# Altium schematic sheet Audio_Input_Line_In.SchDoc: Audio In
size 279 x 215 mm; DrawnBy: Connor Dack; Engineer: Connor Dack; DocumentNumber: 9; Revision: 1.0; SheetNumber: 9; SheetTotal: 11
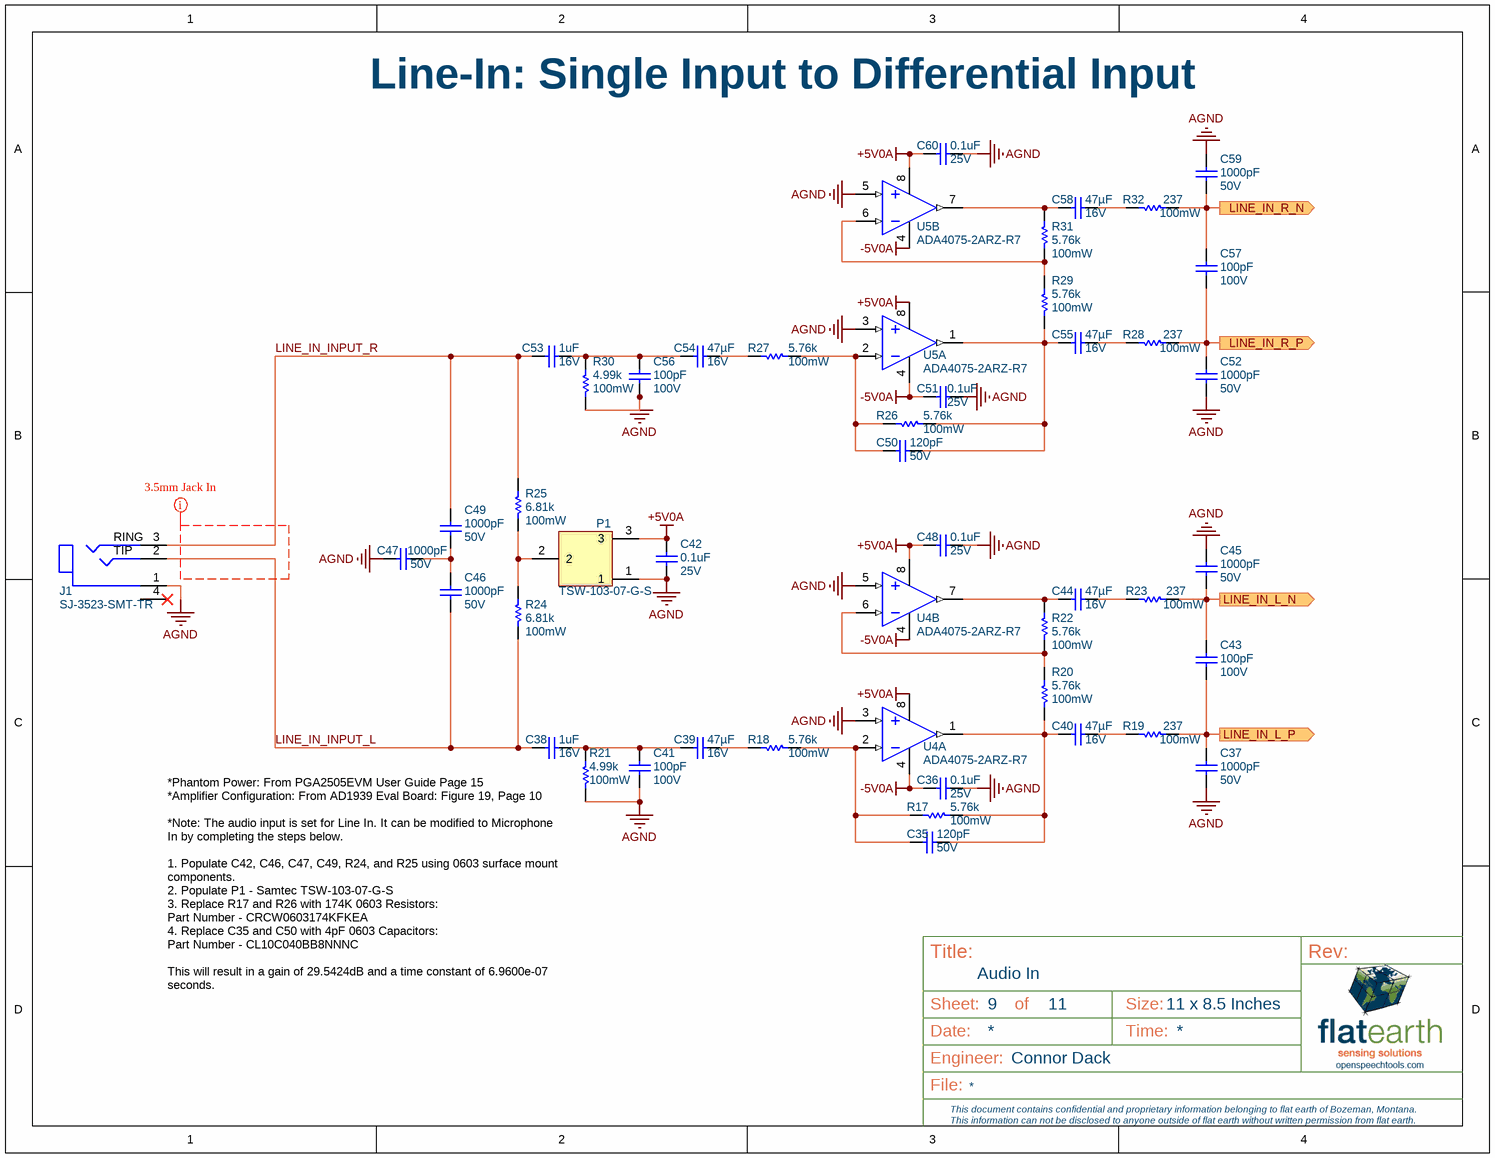
[diagram p0: Audio_Input_Line_In.SchDoc]

## Parts
C35  Voltage - Rated: 50V  Capacitance: 120pF  [3-0603_L]  (hidden comment: CL10C121JB8NCNC)
C36  Voltage Rating: 25V  Capacitance: 0.1uF  [3-0603_L]  (hidden comment: CGA3E2X7R1E104K080AA)
C37  Voltage - Rated: 50V  Capacitance: 1000pF  [3-0603_L]  (hidden comment: CL10B102KB8NNNC)
C38  Voltage Rating (DC): 16V  Capacitance: 1uF  [3-0603_L]  (hidden comment: CGA3E1X7R1C105M080AC)
C39  Voltage - Rated: 16V  Capacitance: 47µF  [C1210X25_L]  (hidden comment: GRM32EC81C476KE15L)
C40  Voltage - Rated: 16V  Capacitance: 47µF  [C1210X25_L]  (hidden comment: GRM32EC81C476KE15L)
C41  Voltage - Rated: 100V  Capacitance: 100pF  [3-0603_L]  (hidden comment: C1608C0G2A101J)
C42  Voltage Rating: 25V  Capacitance: 0.1uF  [3-0603_L]  (hidden comment: CGA3E2X7R1E104K080AA)
C43  Voltage - Rated: 100V  Capacitance: 100pF  [3-0603_L]  (hidden comment: C1608C0G2A101J)
C44  Voltage - Rated: 16V  Capacitance: 47µF  [C1210X25_L]  (hidden comment: GRM32EC81C476KE15L)
C45  Voltage - Rated: 50V  Capacitance: 1000pF  [3-0603_L]  (hidden comment: CL10B102KB8NNNC)
C46  Voltage - Rated: 50V  Capacitance: 1000pF  [3-0603_L_DNP]  (hidden comment: C1608C0G1H102J)
C47  Voltage - Rated: 50V  Capacitance: 1000pF  [3-0603_L_DNP]  (hidden comment: C1608C0G1H102J)
C48  Voltage Rating: 25V  Capacitance: 0.1uF  [3-0603_L]  (hidden comment: CGA3E2X7R1E104K080AA)
C49  Voltage - Rated: 50V  Capacitance: 1000pF  [3-0603_L_DNP]  (hidden comment: C1608C0G1H102J)
C50  Voltage - Rated: 50V  Capacitance: 120pF  [3-0603_L]  (hidden comment: CL10C121JB8NCNC)
C51  Voltage Rating: 25V  Capacitance: 0.1uF  [3-0603_L]  (hidden comment: CGA3E2X7R1E104K080AA)
C52  Voltage - Rated: 50V  Capacitance: 1000pF  [3-0603_L]  (hidden comment: CL10B102KB8NNNC)
C53  Voltage Rating: 16V  Capacitance: 1uF  [3-0603_L]  (hidden comment: CGA3E1X7R1C105M080AC)
C54  Voltage - Rated: 16V  Capacitance: 47µF  [C1210X25_L]  (hidden comment: GRM32EC81C476KE15L)
C55  Voltage - Rated: 16V  Capacitance: 47µF  [C1210X25_L]  (hidden comment: GRM32EC81C476KE15L)
C56  Voltage - Rated: 100V  Capacitance: 100pF  [3-0603_L]  (hidden comment: C1608C0G2A101J)
C57  Voltage - Rated: 100V  Capacitance: 100pF  [3-0603_L]  (hidden comment: C1608C0G2A101J)
C58  Voltage - Rated: 16V  Capacitance: 47µF  [C1210X25_L]  (hidden comment: GRM32EC81C476KE15L)
C59  Voltage - Rated: 50V  Capacitance: 1000pF  [3-0603_L]  (hidden comment: CL10B102KB8NNNC)
C60  Voltage Rating: 25V  Capacitance: 0.1uF  [3-0603_L]  (hidden comment: CGA3E2X7R1E104K080AA)
J1  SJ-3523-SMT-TR  [SJ-3523-SMT-TR]
P1  TSW-103-07-G-S  [3Pin_Header]
R17  Power (Watts): 100mW  Resistance (Ohms): 5.76k  [3-0603_R_L]  (hidden comment: ERJ-3EKF5761V)
R18  Power (Watts): 100mW  Resistance (Ohms): 5.76k  [3-0603_R_L]  (hidden comment: ERJ-3EKF5761V)
R19  Power (Watts): 100mW  Resistance (Ohms): 237  [3-0603_R_L]  (hidden comment: ERJ-3EKF2370V)
R20  Power (Watts): 100mW  Resistance (Ohms): 5.76k  [3-0603_R_L]  (hidden comment: ERJ-3EKF5761V)
R21  Power (Watts): 100mW  Resistance (Ohms): 4.99k  [3-0603_R_L]  (hidden comment: ERJ-3EKF4991V)
R22  Power (Watts): 100mW  Resistance (Ohms): 5.76k  [3-0603_R_L]  (hidden comment: ERJ-3EKF5761V)
R23  Power (Watts): 100mW  Resistance (Ohms): 237  [3-0603_R_L]  (hidden comment: ERJ-3EKF2370V)
R24  Power Rating: 100mW  Resistance: 6.81k  [3-0603_R_L_DNP]  (hidden comment: ERJ-3EKF6811V)
R25  Power Rating: 100mW  Resistance: 6.81k  [3-0603_R_L_DNP]  (hidden comment: ERJ-3EKF6811V)
R26  Power (Watts): 100mW  Resistance (Ohms): 5.76k  [3-0603_R_L]  (hidden comment: ERJ-3EKF5761V)
R27  Power (Watts): 100mW  Resistance (Ohms): 5.76k  [3-0603_R_L]  (hidden comment: ERJ-3EKF5761V)
R28  Power (Watts): 100mW  Resistance (Ohms): 237  [3-0603_R_L]  (hidden comment: ERJ-3EKF2370V)
R29  Power (Watts): 100mW  Resistance (Ohms): 5.76k  [3-0603_R_L]  (hidden comment: ERJ-3EKF5761V)
R30  Power (Watts): 100mW  Resistance (Ohms): 4.99k  [3-0603_R_L]  (hidden comment: ERJ-3EKF4991V)
R31  Power (Watts): 100mW  Resistance (Ohms): 5.76k  [3-0603_R_L]  (hidden comment: ERJ-3EKF5761V)
R32  Power (Watts): 100mW  Resistance (Ohms): 237  [3-0603_R_L]  (hidden comment: ERJ-3EKF2370V)
U4  ADA4075-2ARZ-R7  [SOIC127P600X175-8N]  (parts A,B of 2)
U5  ADA4075-2ARZ-R7  [SOIC127P600X175-8N]  (parts A,B of 2)

## Ports
LINE_IN_L_N (out), LINE_IN_L_P (out), LINE_IN_R_N (out), LINE_IN_R_P (out)

## Nets
+5V0A: C42.2 C48.2 C60.2 P1.3 U4.8(V+) U5.8(V+)
-5V0A: C36.2 C51.2 U4.4(V-) U5.4(V-)
AGND: C36.1 C37.1 C41.2 C42.1 C45.1 C47.2 C48.1 C51.1 C52.1 C56.2 C59.1 C60.1 J1.1(Sleeve) P1.1 R21.1 R30.1 U4.3(+INA) U4.5(+INB) U5.3(+INA) U5.5(+INB)
LINE_IN_INPUT_L: C38.1 C46.2 J1.2(Tip) R24.2
LINE_IN_INPUT_R: C49.1 C53.1 J1.3(Ring) R25.1
LINE_IN_L_N: C43.1 C45.2 R23.2 ; port LINE_IN_L_N
LINE_IN_L_P: C37.2 C43.2 R19.2 ; port LINE_IN_L_P
LINE_IN_R_N: C57.1 C59.2 R32.2 ; port LINE_IN_R_N
LINE_IN_R_P: C52.2 C57.2 R28.2 ; port LINE_IN_R_P
NetC35_1: C35.1 R17.1 R18.2 U4.2(-INA)
NetC35_2: C35.2 C40.1 R17.2 R20.1 U4.1(OUTA)
NetC38_2: C38.2 C39.1 C41.1 R21.2
NetC39_2: C39.2 R18.1
NetC40_2: C40.2 R19.1
NetC44_1: C44.1 R22.2 U4.7(OUTB)
NetC44_2: C44.2 R23.1
NetC46_1: C46.1 C47.1 C49.2
NetC50_1: C50.1 C55.1 R26.2 R29.1 U5.1(OUTA)
NetC50_2: C50.2 R26.1 R27.2 U5.2(-INA)
NetC53_2: C53.2 C54.1 C56.1 R30.2
NetC54_2: C54.2 R27.1
NetC55_2: C55.2 R28.1
NetC58_1: C58.1 R31.2 U5.7(OUTB)
NetC58_2: C58.2 R32.1
NetP1_2: P1.2 R24.1 R25.2
NetR20_2: R20.2 R22.1 U4.6(-INB)
NetR29_2: R29.2 R31.1 U5.6(-INB)

Not connected (* = marked no-connect by the designer): J1 4(NC)*

## Layout directives
net class 3.5mm Jack In: (no net found under the mark)

## Notes on the sheet
- Line-In: Single Input to Differential Input
- *Phantom Power: From PGA2505EVM User Guide Page 15
  *Amplifier Configuration: From AD1939 Eval Board: Figure 19, Page 10
  *Note: The audio input is set for Line In. It can be modified to Microphone In by completing the steps below.
  1. Populate C42, C46, C47, C49, R24, and R25 using 0603 surface mount components.
  2. Populate P1 - Samtec TSW-103-07-G-S
  3. Replace R17 and R26 with 174K 0603 Resistors:
  Part Number - CRCW0603174KFKEA
  4. Replace C35 and C50 with 4pF 0603 Capacitors:
  Part Number - CL10C040BB8NNNC
  This will result in a gain of 29.5424dB and a time constant of 6.9600e-07 seconds.
- Title:
- Rev:
- Sheet:
- Date:
- of
- Time:
- Size:
- 11 x 8.5 Inches
- Engineer:
- File:
- This document contains confidential and proprietary information belonging to flat earth of Bozeman, Montana.
  This information can not be disclosed to anyone outside of flat earth without written permission from flat earth.
- (in symbol SJ-3523-SMT-TR) RING; TIP

## Library data of the parts
C35 C50 = CL10C121JB8NCNC: 120pF 50V Ceramic Capacitor C0G, NP0 0603 (1608 Metric) 0.063" L x 0.031" W (1.60mm x 0.80mm); Manufacturer: Samsung Electro-Mechanics America, Inc.; Tolerance: ±5%; Supplier 1: Digi-Key; Manufacturer Part Number: CL10C121JB8NCNC; RoHS: RoHS Compliant; Category: Capacitors; Stock 1: 26285; Pricing 1: 1=0.1, 10=0.03, 25=0.0208, 50=0.016, 100=0.0135, 500=0.00948, 1000=0.00738 (USD); Packaging: Cut Tape (CT); Part Status: Active; Temperature Coefficient: C0G, NP0; Mounting Type: Surface Mount, MLCC; Operating Temperature: -55°C ~ 125°C; Applications: General Purpose; Ratings: -; Package / Case: 0603 (1608 Metric); Size / Dimension: 0.063" L x 0.031" W (1.60mm x 0.80mm); Height - Seated (Max): -; Thickness (Max): 0.035" (0.90mm); Lead Spacing: -; Features: -; Lead Style: -; ComponentLink1URL: http://media.digikey.com/pdf/Data%20Sheets/Samsung%20PDFs/CL10C121JB8NCNC_Spec.pdf; ComponentLink1Description: http://media.digikey.com/pdf/Data%20Sheets/Samsung%20PDFs/CL10C121JB8NCNC_Spec.pdf; Supplier Part Number 1: 1276-2180-1-ND; Load Status: *
C36 C42 C48 C51 C60 = CGA3E2X7R1E104K080AA: CAP CER 0.1UF 25V X7R 0603; Manufacturer: TDK; Tolerance: 10%; ComponentLink1URL: https://datasheet.ciiva.com/24218/cga3e2x7r1h332k080aa-266003-24218741.pdf; ComponentLink1Description: https://datasheet.ciiva.com/24218/cga3e2x7r1h332k080aa-266003-24218741.pdf; Supplier 1: Digi-Key; Manufacturer Part Number: CGA3E2X7R1E104K080AA; Stock 1: 170098; Pricing 1: 1=0.1, 10=0.063, 100=0.0279, 500=0.0199, 1000=0.0156 (USD); Mount: Surface Mount; Case/Package: 0603; Weight: 7.1E-05oz; Case Code (Metric): 1608; Case Code (Imperial): 0603; Min Operating Temperature: -55°C; Max Operating Temperature: 125°C; Packaging: Tape and Reel; Package Quantity: 1; Voltage Rating (DC): 25V; Dielectric: X7R; Termination: SMD/SMT; Composition: Ceramic; Length: 1.6mm; Height: 0.8mm; Width: 0.031inch; Thickness: 0.035inch; Depth: 0.8mm; REACH SVHC: No SVHC; Lead Free: Lead Free; ComponentLink2URL: https://datasheet.ciiva.com/22725/1735392-22725638.pdf; ComponentLink2Description: https://datasheet.ciiva.com/22725/1735392-22725638.pdf; ComponentLink3URL: https://datasheet.ciiva.com/24220/cga3e2x7r1e104k080aa-265934-24220022.pdf; ComponentLink3Description: https://datasheet.ciiva.com/24220/cga3e2x7r1e104k080aa-265934-24220022.pdf; ComponentLink4URL: https://datasheet.ciiva.com/22725/1735392-22725639.pdf; ComponentLink4Description: https://datasheet.ciiva.com/22725/1735392-22725639.pdf; ComponentLink5URL: https://datasheet.ciiva.com/16427/mlccspec-automotive-general-midvoltage-en-16427320.pdf; ComponentLink5Description: https://datasheet.ciiva.com/16427/mlccspec-automotive-general-midvoltage-en-16427320.pdf; ComponentLink6URL: https://datasheet.ciiva.com/23803/1735392-23803082.pdf; ComponentLink6Description: https://datasheet.ciiva.com/23803/1735392-23803082.pdf; Supplier Part Number 1: 445-5667-6-ND
  C42: Load Status: *
C37 C45 C52 C59 = CL10B102KB8NNNC: 1000pF 50V Ceramic Capacitor X7R 0603 (1608 Metric) 0.063" L x 0.031" W (1.60mm x 0.80mm); Manufacturer: Samsung Electro-Mechanics America, Inc.; Tolerance: ±10%; Supplier 1: Digi-Key; Manufacturer Part Number: CL10B102KB8NNNC; RoHS: RoHS Compliant; Category: Capacitors; Stock 1: 294007; Pricing 1: 1=0.1, 10=0.017, 25=0.012, 50=0.0092, 100=0.0077, 500=0.0054, 1000=0.0042 (USD); Packaging: Cut Tape (CT); Part Status: Active; Temperature Coefficient: X7R; Mounting Type: Surface Mount, MLCC; Operating Temperature: -55°C ~ 125°C; Applications: General Purpose; Ratings: -; Package / Case: 0603 (1608 Metric); Size / Dimension: 0.063" L x 0.031" W (1.60mm x 0.80mm); Height - Seated (Max): -; Thickness (Max): 0.035" (0.90mm); Lead Spacing: -; Features: -; Lead Style: -; ComponentLink1URL: http://www.samsungsem.com/kr/support/product-search/mlcc/__icsFiles/afieldfile/2015/06/15/CL10B102KB8NNNC.pdf; ComponentLink1Description: http://www.samsungsem.com/kr/support/product-search/mlcc/__icsFiles/afieldfile/2015/06/15/CL10B102KB8NNNC.pdf; Supplier Part Number 1: 1276-1018-1-ND; Load Status: *
C38 C53 = CGA3E1X7R1C105M080AC: CAP CER 1UF 16V X7R 0603; Manufacturer: TDK; Tolerance: 20%; Supplier 1: Digi-Key; Manufacturer Part Number: CGA3E1X7R1C105M080AC; Stock 1: 18034; Pricing 1: 1=0.14, 10=0.1, 100=0.0468, 500=0.0328, 1000=0.0272 (USD); Mount: Surface Mount; Case/Package: 0603; Weight: 7.1E-05oz; Case Code (Metric): 1608; Case Code (Imperial): 0603; Min Operating Temperature: -55°C; Max Operating Temperature: 125°C; Package Quantity: 4000; Packaging: Tape and Reel; Dielectric: X7R; Termination: SMD/SMT; Length: 0.063inch; Height: 0.8mm; Width: 0.031inch; Thickness: 0.035inch; Lead Free: Lead Free; ComponentLink1URL: https://product.tdk.com/info/en/catalog/datasheets/mlcc_automotive_general_en.pdf; ComponentLink1Description: https://product.tdk.com/info/en/catalog/datasheets/mlcc_automotive_general_en.pdf; ComponentLink2URL: http://product.tdk.com/capacitor/mlcc/detailed_information.php?lang=en&ref=jp&part_no=CGA3E1X7R1C105M080AC; ComponentLink2Description: http://product.tdk.com/capacitor/mlcc/detailed_information.php?lang=en&ref=jp&part_no=CGA3E1X7R1C105M080AC; ComponentLink3URL: http://product.tdk.com/en/catalog/datasheets/mlcc_automotive_general_en.pdf; ComponentLink3Description: http://product.tdk.com/en/catalog/datasheets/mlcc_automotive_general_en.pdf; Supplier Part Number 1: 445-12540-6-ND
  C38: Voltage Rating: 16V
  C53: Voltage Rating (DC): 16V
C39 C40 C44 C54 C55 C58 = GRM32EC81C476KE15L: 47µF ±10% 16V Ceramic Capacitor X6S 1210 (3225 Metric); Manufacturer: Murata Electronics North America; Supplier 1: Digi-Key; Manufacturer Part Number: GRM32EC81C476KE15L; RoHS: RoHS Compliant; Category: Capacitors; Stock 1: 39641; Pricing 1: 1=0.73, 10=0.697, 25=0.4944, 50=0.4164, 100=0.3383, 250=0.28108, 500=0.25504 (USD); Packaging: Cut Tape (CT); Tolerance: ±10%; Temperature Coefficient: X6S; Mounting Type: Surface Mount, MLCC; Operating Temperature: -55°C ~ 105°C; Applications: General Purpose; Ratings: -; Package / Case: 1210 (3225 Metric); Size / Dimension: 0.126" L x 0.098" W (3.20mm x 2.50mm); Height - Seated (Max): -; Thickness (Max): 0.106" (2.70mm); Lead Spacing: -; Features: Derating Recommended; Lead Style: -; ComponentLink1URL: http://www.murata.com/~/media/webrenewal/support/library/catalog/products/capacitor/mlcc/c02e.pdf; ComponentLink1Description: http://www.murata.com/~/media/webrenewal/support/library/catalog/products/capacitor/mlcc/c02e.pdf; Supplier Part Number 1: 490-10531-1-ND; Part Status: Active; Failure Rate: *; Load Status: *
C41 C43 C56 C57 = C1608C0G2A101J: CAP CER 100PF 100V 5% NP0 0603; Manufacturer: TDK Corporation; Temperature Coefficient: C0G, NP0; Supplier 1: Digi-Key; Manufacturer Part Number: C1608C0G2A101J; RoHS: RoHS Compliant; Category: Capacitors; Stock 1: 128588; Pricing 1: 10=0.05, 100=0.0231, 250=0.01892, 500=0.01618, 1000=0.0126 (USD); Tolerance: ±5%; Mounting Type: Surface Mount, MLCC; Operating Temperature: -55°C ~ 125°C; Applications: General Purpose; Ratings: -; Package / Case: 0603 (1608 Metric); Size / Dimension: 0.063" L x 0.031" W (1.60mm x 0.80mm); Height - Seated (Max): -; Thickness (Max): 0.037" (0.95mm); Lead Spacing: -; Features: -; Packaging: Cut Tape (CT); Lead Style: -; ComponentLink1URL: http://www.tdk.com/pdf/mid_volt_B11.pdf; ComponentLink1Description: http://www.tdk.com/pdf/mid_volt_B11.pdf; Supplier Part Number 1: 445-2306-1-ND; Load Status: *
C46 C47 C49 = C1608C0G1H102J: CAP CER 1000PF 50V 5% NP0 0603; Manufacturer: TDK Corporation; Temperature Coefficient: C0G, NP0; Supplier 1: Digi-Key; Manufacturer Part Number: C1608C0G1H102J; RoHS: RoHS Compliant; Category: Capacitors; Stock 1: 229834; Pricing 1: 10=0.078, 100=0.0358, 250=0.02924, 500=0.02502, 1000=0.0195 (USD); Tolerance: ±5%; Mounting Type: Surface Mount, MLCC; Operating Temperature: -55°C ~ 125°C; Applications: General Purpose; Ratings: -; Package / Case: 0603 (1608 Metric); Size / Dimension: 0.063" L x 0.031" W (1.60mm x 0.80mm); Height - Seated (Max): -; Thickness (Max): 0.037" (0.95mm); Lead Spacing: -; Features: -; Packaging: Cut Tape (CT); Lead Style: -; ComponentLink1URL: http://www.tdk.com/pdf/general_B11.pdf; ComponentLink1Description: http://www.tdk.com/pdf/general_B11.pdf; Supplier Part Number 1: 445-1293-1-ND; Load Status: *
J1 = SJ-3523-SMT-TR: 3.50mm (0.141", 1/8", Mini Plug) - Headphone Phone Jack Stereo Connector Solder; Manufacturer: CUI Inc.; Gender: Female; Actual Diameter: 0.142" (3.60mm); Number of Positions/Contacts: 3 Conductors, 3 Contacts; Internal Switch(s): Does Not Contain Switch; Shielding: Unshielded; Voltage - Rated: 12VDC; Current Rating: 1A; Mating Length/Depth: 0.551" (14.00mm); Body Color: Black; Includes: 1 pc - 1 Connector; LatestRevisionDate: 17-Jul-2002; LatestRevisionNote: Re-released for DXP Platform.; Publisher: Altium Limited; Supplier 1: Digi-Key; RoHS: RoHS Compliant; Category: Connectors, Interconnects; Stock 1: 104981; Pricing 1: 1=1.34, 10=1.043, 100=0.7961, 500=0.63558 (USD); Packaging: Cut Tape (CT); Part Status: Active; Connector Type: Phone Jack; Signal Lines: Stereo; Industry Recognized Mating Diameter: 3.50mm (0.141", 1/8", Mini Plug) - Headphone; Mounting Type: Surface Mount, Right Angle; Termination: Solder; Features: Board Guide; Insulation Color: -; Contact Material - Plating: Silver; Body Material: -; ComponentLink1URL: http://www.cui.com/product/resource/digikeypdf/sj-352x-smt_series.pdf; ComponentLink1Description: http://www.cui.com/product/resource/digikeypdf/sj-352x-smt_series.pdf; Supplier Part Number 1: CP-3523SJCT-ND; Manufacturer Part Number: SJ-3523-SMT-TR
P1 = CONN_TH_3PIN_0D1: 3 Pin Through Hole Connector with 0.1" Spacing; Manufacturer: Samtec; LatestRevisionDate: 17-Jul-2002; LatestRevisionNote: Re-released for DXP Platform.; Publisher: Altium Limited; Manufacturer Part Number: TSW-103-07-G-S; Supplier 1: Samtec; Supplier Part Number 1: TSW-103-07-G-S
R17 R18 R20 R22 R26 R27 R29 R31 = ERJ-3EKF5761V: RES SMD 5.76K OHM 1% 1/10W 0603; Manufacturer: Panasonic Electronic Components; Temperature Coefficient: ±100ppm/°C; Supplier 1: Digi-Key; Manufacturer Part Number: ERJ-3EKF5761V; RoHS: RoHS Compliant; Category: Resistors; Stock 1: 90842; Pricing 1: 1=0.1, 50=0.0114, 100=0.0084, 250=0.00644, 500=0.00514, 1000=0.00379 (USD); Packaging: Cut Tape (CT); Part Status: Active; Tolerance: ±1%; Composition: Thick Film; Features: Automotive AEC-Q200; Operating Temperature: -55°C ~ 155°C; Package / Case: 0603 (1608 Metric); Supplier Device Package: 0603; Size / Dimension: 0.063" L x 0.031" W (1.60mm x 0.80mm); Height: 0.022" (0.55mm); Number of Terminations: 2; ComponentLink1URL: http://industrial.panasonic.com/www-cgi/jvcr13pz.cgi?E+PZ+3+AOA0002+ERJ3EKF5761V+7+WW; ComponentLink1Description: http://industrial.panasonic.com/www-cgi/jvcr13pz.cgi?E+PZ+3+AOA0002+ERJ3EKF5761V+7+WW; Supplier Part Number 1: P5.76KHCT-ND; Load Status: *
R19 R23 R28 R32 = ERJ-3EKF2370V: RES SMD 237 OHM 1% 1/10W 0603; Manufacturer: Panasonic Electronic Components; Temperature Coefficient: ±100ppm/°C; Supplier 1: Digi-Key; Manufacturer Part Number: ERJ-3EKF2370V; RoHS: RoHS Compliant; Category: Resistors; Stock 1: 74413; Pricing 1: 1=0.1, 50=0.0114, 100=0.0084, 250=0.00644, 500=0.00514, 1000=0.00379 (USD); Packaging: Cut Tape (CT); Part Status: Active; Tolerance: ±1%; Composition: Thick Film; Features: Automotive AEC-Q200; Operating Temperature: -55°C ~ 155°C; Package / Case: 0603 (1608 Metric); Supplier Device Package: 0603; Size / Dimension: 0.063" L x 0.031" W (1.60mm x 0.80mm); Height: 0.022" (0.55mm); Number of Terminations: 2; ComponentLink1URL: http://industrial.panasonic.com/www-cgi/jvcr13pz.cgi?E+PZ+3+AOA0002+ERJ3EKF2370V+7+WW; ComponentLink1Description: http://industrial.panasonic.com/www-cgi/jvcr13pz.cgi?E+PZ+3+AOA0002+ERJ3EKF2370V+7+WW; Supplier Part Number 1: P237HCT-ND; Load Status: *
R21 R30 = ERJ-3EKF4991V: RES SMD 4.99K OHM 1% 1/10W 0603; Manufacturer: Panasonic Electronic Components; Temperature Coefficient: ±100ppm/°C; Supplier 1: Digi-Key; Manufacturer Part Number: ERJ-3EKF4991V; RoHS: RoHS Compliant; Category: Resistors; Stock 1: 870970; Pricing 1: 1=0.1, 50=0.0114, 100=0.0084, 250=0.00644, 500=0.00514, 1000=0.00379 (USD); Packaging: Cut Tape (CT); Part Status: Active; Tolerance: ±1%; Composition: Thick Film; Features: Automotive AEC-Q200; Operating Temperature: -55°C ~ 155°C; Package / Case: 0603 (1608 Metric); Supplier Device Package: 0603; Size / Dimension: 0.063" L x 0.031" W (1.60mm x 0.80mm); Height: 0.022" (0.55mm); Number of Terminations: 2; ComponentLink1URL: http://industrial.panasonic.com/www-cgi/jvcr13pz.cgi?E+PZ+3+AOA0002+ERJ3EKF4991V+7+WW; ComponentLink1Description: http://industrial.panasonic.com/www-cgi/jvcr13pz.cgi?E+PZ+3+AOA0002+ERJ3EKF4991V+7+WW; Supplier Part Number 1: P4.99KHCT-ND; Load Status: *
R24 R25 = ERJ-3EKF6811V: RES SMD 6.81K OHM 1% 1/10W 0603; Manufacturer: Panasonic ECG; Voltage Rating: 75V; Temperature Coefficient: 100ppm/°C; Voltage Rating (DC): 50V; Stock 1: 326226; Pricing 1: 1=0.1, 10=0.063, 100=0.0257, 1000=0.0115, 2500=0.01 (USD); Mount: Surface Mount; Case/Package: 0603; Case Code (Imperial): 0603; Case Code (Metric): 1608; Contact Plating: Tin; Min Operating Temperature: -55°C; Max Operating Temperature: 155°C; Tolerance: 1%; Packaging: Tape and Reel; Package Quantity: 1; Composition: Thick Film; Number of Terminations: 2; Termination: SMD/SMT; Military Standard: Not; Max Power Dissipation: 100mW; Length: 1.6mm; Height: 0.45mm; Width: 0.8mm; Depth: 0.8mm; Radiation Hardening: No; REACH SVHC: Unknown; Lead Free: Lead Free; ComponentLink1URL: https://datasheet.ciiva.com/9117/aoa0000ce2-9117125.pdf; ComponentLink1Description: https://datasheet.ciiva.com/9117/aoa0000ce2-9117125.pdf; ComponentLink2URL: https://datasheet.ciiva.com/46389/426256-46389990.pdf; ComponentLink2Description: https://datasheet.ciiva.com/46389/426256-46389990.pdf; ComponentLink3URL: https://datasheet.ciiva.com/24027/aoa0000ce2-24027336.pdf; ComponentLink3Description: https://datasheet.ciiva.com/24027/aoa0000ce2-24027336.pdf; ComponentLink4URL: https://datasheet.ciiva.com/28693/1678782-28693560.pdf; ComponentLink4Description: https://datasheet.ciiva.com/28693/1678782-28693560.pdf; ComponentLink5URL: https://datasheet.ciiva.com/5969/426256-5969386.pdf; ComponentLink5Description: https://datasheet.ciiva.com/5969/426256-5969386.pdf; ComponentLink6URL: https://datasheet.ciiva.com/16440/aoa0000ce2-16440170.pdf; ComponentLink6Description: https://datasheet.ciiva.com/16440/aoa0000ce2-16440170.pdf; ComponentLink7URL: https://datasheet.ciiva.com/48531/aoa0000ce2-48531934.pdf; ComponentLink7Description: https://datasheet.ciiva.com/48531/aoa0000ce2-48531934.pdf; ComponentLink8URL: https://datasheet.ciiva.com/16759/70260748-16759487.pdf; ComponentLink8Description: https://datasheet.ciiva.com/16759/70260748-16759487.pdf; ComponentLink9URL: https://datasheet.ciiva.com/43460/426256-43460527.pdf; ComponentLink9Description: https://datasheet.ciiva.com/43460/426256-43460527.pdf; Supplier Part Number 1: P6.81KHDKR-ND; Supplier 1: Digi-Key; Manufacturer Part Number: ERJ-3EKF6811V; Load Status: *
U4 U5 = ADA4075-2ARZ-R7: IC OPAMP GP 6.5MHZ 8SOIC; Manufacturer: Analog Devices Inc.; Amplifier Type: General Purpose; Number of Circuits: 2; Slew Rate: 12 V/µs; Current - Input Bias: 30nA; Voltage - Input Offset: 200µV; Current - Supply: 1.8mA; Current - Output / Channel: 40mA; Voltage - Supply, Single/Dual (±): ±4.5 V ~ 18 V; Supplier 1: Digi-Key; RoHS: RoHS Compliant; Category: Integrated Circuits (ICs); Stock 1: 11196; Pricing 1: 1=2.28, 10=2.05, 100=1.6441, 500=1.35136 (USD); Packaging: Cut Tape (CT); Part Status: Active; Output Type: -; Gain Bandwidth Product: 6.5MHz; -3db Bandwidth: -; Operating Temperature: -40°C ~ 125°C; Mounting Type: Surface Mount; Package / Case: 8-SOIC (0.154", 3.90mm Width); Supplier Device Package: 8-SOIC; ComponentLink1URL: http://www.analog.com/media/en/technical-documentation/data-sheets/ADA4075-2.pdf; ComponentLink1Description: http://www.analog.com/media/en/technical-documentation/data-sheets/ADA4075-2.pdf; Supplier Part Number 1: ADA4075-2ARZ-R7CT-ND; Manufacturer Part Number: ADA4075-2ARZ-R7